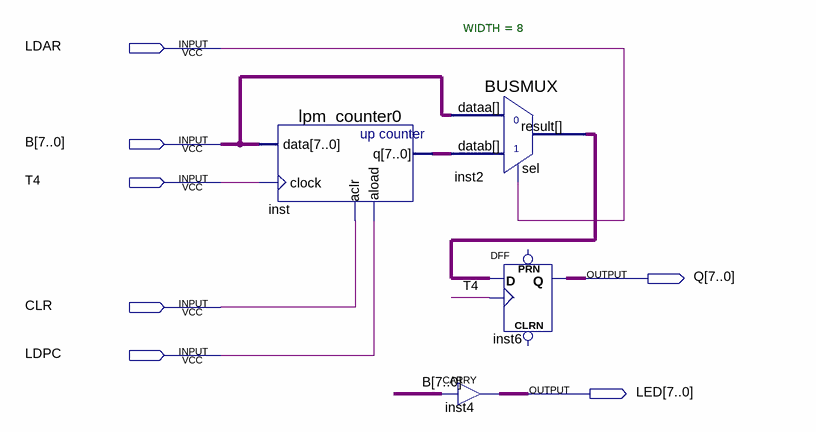
[diagram p0: schematic sheet]
// Quartus schematic Block1.bdf as structural Verilog: 4 symbols, 7 pins
module Block1 (
  input  LDAR,
  input  [7:0] B,
  input  T4,
  input  CLR,
  input  LDPC,
  output [7:0] Q,
  output [7:0] LED
);

  wire [7:0] inst2_result, inst_q;

  lpm_counter0 inst (.data(B), .clock(T4), .aclr(CLR), .aload(LDPC), .q(inst_q));
  BUSMUX #(.WIDTH(8)) inst2 (.datab(inst_q), .sel(LDAR), .dataa(B), .result(inst2_result));
  DFF inst6[7:0] (.CLK(T4), .D(inst2_result), .Q(Q));  // open: CLRN, PRN
  CARRY inst4[7:0] (.IN(B), .OUT(LED));
endmodule
